# EAGLE design miwos (EAGLE 9.6.2)
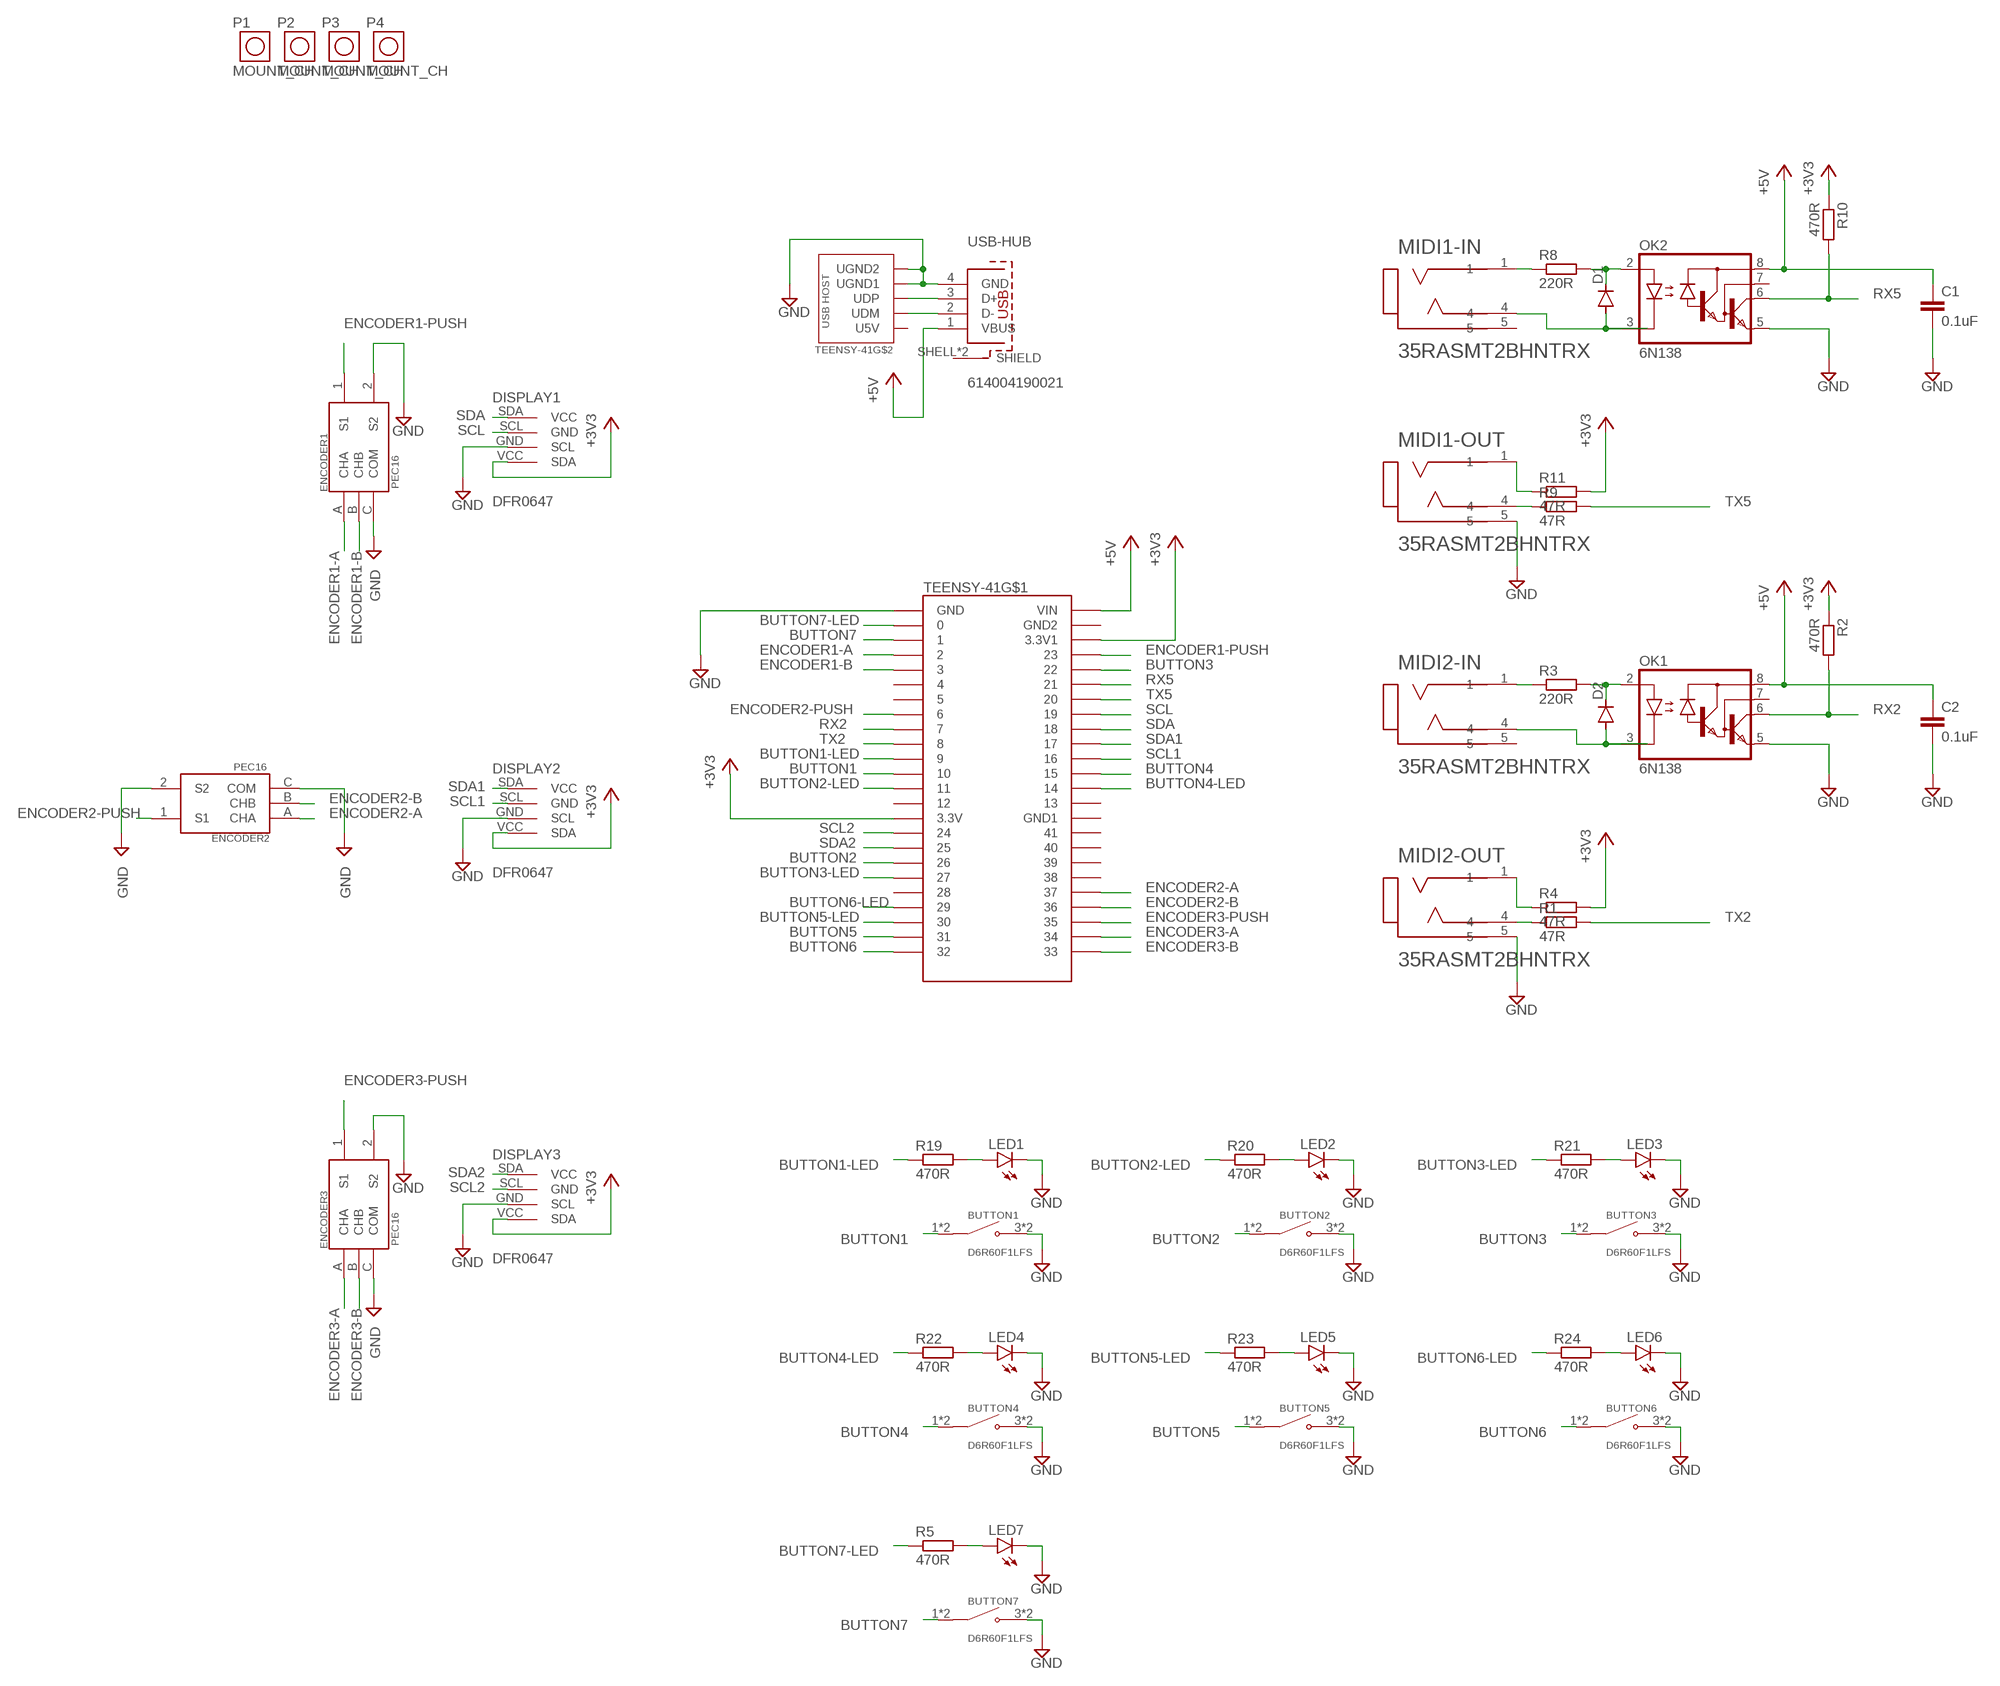
[diagram p0: schematic, sheet 1]

## Parts
BUTTON1  D6R60F1LFS  [D6R]
BUTTON2  D6R60F1LFS  [D6R]
BUTTON3  D6R60F1LFS  [D6R]
BUTTON4  D6R60F1LFS  [D6R]
BUTTON5  D6R60F1LFS  [D6R]
BUTTON6  D6R60F1LFS  [D6R]
BUTTON7  D6R60F1LFS  [D6R]
C1  0.1uF  C-EUC0603  [C0603]
C2  0.1uF  C-EUC0603  [C0603]
D1  DIODE-SOD123  [SOD123]
D2  DIODE-SOD123  [SOD123]
DISPLAY1  DFR0647  [DFR0647]
DISPLAY2  DFR0647  [DFR0647]
DISPLAY3  DFR0647  [DFR0647]
ENCODER1  PEC16  [PEC16]
ENCODER2  PEC16  [PEC16]
ENCODER3  PEC16  [PEC16]
LED1  LED3MM  [LED3MM]
LED2  LED3MM  [LED3MM]
LED3  LED3MM  [LED3MM]
LED4  LED3MM  [LED3MM]
LED5  LED3MM  [LED3MM]
LED6  LED3MM  [LED3MM]
LED7  LED3MM  [LED3MM]
MIDI1-IN  35RASMT2BHNTRX  [SWITCHCRAFT_35RASMT2BHNTRX]
MIDI1-OUT  35RASMT2BHNTRX  [SWITCHCRAFT_35RASMT2BHNTRX]
MIDI2-IN  35RASMT2BHNTRX  [SWITCHCRAFT_35RASMT2BHNTRX]
MIDI2-OUT  35RASMT2BHNTRX  [SWITCHCRAFT_35RASMT2BHNTRX]
OK1  6N138  [DIP08-SMD]
OK2  6N138  [DIP08-SMD]
P1  MOUNT_CH  [MOUNT_CH32]
P2  MOUNT_CH  [MOUNT_CH32]
P3  MOUNT_CH  [MOUNT_CH32]
P4  MOUNT_CH  [MOUNT_CH32]
R1  47R  R-EU_R0603  [R0603]
R2  470R  R-EU_R0603  [R0603]
R3  220R  R-EU_R0603  [R0603]
R4  47R  R-EU_R0603  [R0603]
R5  470R  R-EU_R0603  [R0603]
R8  220R  R-EU_R0603  [R0603]
R9  47R  R-EU_R0603  [R0603]
R10  470R  R-EU_R0603  [R0603]
R11  47R  R-EU_R0603  [R0603]
R19  470R  R-EU_R0603  [R0603]
R20  470R  R-EU_R0603  [R0603]
R21  470R  R-EU_R0603  [R0603]
R22  470R  R-EU_R0603  [R0603]
R23  470R  R-EU_R0603  [R0603]
R24  470R  R-EU_R0603  [R0603]
TEENSY-41  TEENSY4.1  [TEENSY4.1]
USB-HUB  614004190021  [614004190021]

## Nets
+3V3: DISPLAY1.VCC(SDA) DISPLAY2.VCC(SDA) DISPLAY3.VCC(SDA) R2.1 R4.2 R10.1 R11.2 TEENSY-41.3V3(3.3V) TEENSY-41.3V3_LO(3.3V1)
+5V: C1.1 C2.1 OK1.8(VCC) OK2.8(VCC) TEENSY-41.VIN USB-HUB.1(VBUS)
BUTTON1: BUTTON1.1(COM) BUTTON1.2(COM) TEENSY-41.10/CS
BUTTON1-LED: R19.1 TEENSY-41.9
BUTTON2: BUTTON2.1(COM) BUTTON2.2(COM) TEENSY-41.26
BUTTON2-LED: R20.1 TEENSY-41.11/MOSI
BUTTON3: BUTTON3.1(COM) BUTTON3.2(COM) TEENSY-41.22/A8
BUTTON3-LED: R21.1 TEENSY-41.27
BUTTON4: BUTTON4.1(COM) BUTTON4.2(COM) TEENSY-41.15/A1
BUTTON4-LED: R22.1 TEENSY-41.14/A0
BUTTON5: BUTTON5.1(COM) BUTTON5.2(COM) TEENSY-41.31/A12
BUTTON5-LED: R23.1 TEENSY-41.30
BUTTON6: BUTTON6.1(COM) BUTTON6.2(COM) TEENSY-41.32
BUTTON6-LED: R24.1 TEENSY-41.29
BUTTON7: BUTTON7.1(COM) BUTTON7.2(COM) TEENSY-41.1/TX
BUTTON7-LED: R5.1 TEENSY-41.0/RX
ENCODER1-A: ENCODER1.A(CHA) TEENSY-41.2
ENCODER1-B: ENCODER1.B(CHB) TEENSY-41.3
ENCODER1-PUSH: ENCODER1.1(S1) TEENSY-41.23/A9
ENCODER2-A: ENCODER2.A(CHA) TEENSY-41.37
ENCODER2-B: ENCODER2.B(CHB) TEENSY-41.36
ENCODER2-PUSH: ENCODER2.1(S1) TEENSY-41.6
ENCODER3-A: ENCODER3.A(CHA) TEENSY-41.34
ENCODER3-B: ENCODER3.B(CHB) TEENSY-41.33
ENCODER3-PUSH: ENCODER3.1(S1) TEENSY-41.35
GND: BUTTON1.3(NO) BUTTON1.4(NO) BUTTON2.3(NO) BUTTON2.4(NO) BUTTON3.3(NO) BUTTON3.4(NO) BUTTON4.3(NO) BUTTON4.4(NO) BUTTON5.3(NO) BUTTON5.4(NO) BUTTON6.3(NO) BUTTON6.4(NO) BUTTON7.3(NO) BUTTON7.4(NO) C1.2 C2.2 DISPLAY1.GND(SCL) DISPLAY2.GND(SCL) DISPLAY3.GND(SCL) ENCODER1.2(S2) ENCODER1.C(COM) ENCODER2.2(S2) ENCODER2.C(COM) ENCODER3.2(S2) ENCODER3.C(COM) LED1.K(C) LED2.K(C) LED3.K(C) LED4.K(C) LED5.K(C) LED6.K(C) LED7.K(C) MIDI1-OUT.5 MIDI2-OUT.5 OK1.5(GND) OK2.5(GND) TEENSY-41.GND TEENSY-41.GND-U1(UGND1) TEENSY-41.GND-U2(UGND2) USB-HUB.4(GND)
N$2: TEENSY-41.UD-(UDM) USB-HUB.2(D-)
N$3: TEENSY-41.UD+(UDP) USB-HUB.3(D+)
N$5: LED7.A R5.2
N$8: D1.C OK2.2(A) R8.2
N$9: D1.A MIDI1-IN.4 OK2.3(C)
N$10: MIDI1-IN.1 R8.1
N$11: MIDI1-OUT.4 R9.1
N$12: MIDI1-OUT.1 R11.1
N$16: D2.C OK1.2(A) R3.2
N$17: D2.A MIDI2-IN.4 OK1.3(C)
N$18: MIDI2-IN.1 R3.1
N$19: MIDI2-OUT.4 R1.1
N$21: MIDI2-OUT.1 R4.1
N$25: LED1.A R19.2
N$27: LED2.A R20.2
N$29: LED3.A R21.2
N$31: LED4.A R22.2
N$33: LED5.A R23.2
N$35: LED6.A R24.2
RX2: OK1.6(VO) R2.2 TEENSY-41.7
RX5: OK2.6(VO) R10.2 TEENSY-41.21/A7
SCL: DISPLAY1.SCL(GND) TEENSY-41.19/A5/SCL
SCL1: DISPLAY2.SCL(GND) TEENSY-41.16/A2
SCL2: DISPLAY3.SCL(GND) TEENSY-41.24
SDA: DISPLAY1.SDA(VCC) TEENSY-41.18/A4/SDA
SDA1: DISPLAY2.SDA(VCC) TEENSY-41.17/A3
SDA2: DISPLAY3.SDA(VCC) TEENSY-41.25
TX2: R1.2 TEENSY-41.8
TX5: R9.2 TEENSY-41.20/A6
Unconnected: MIDI1-IN.5 MIDI2-IN.5 OK1.7(VB) OK2.7(VB) P1.P$1 P2.P$1 P3.P$1 P4.P$1 TEENSY-41.4 TEENSY-41.5 TEENSY-41.12/MISO TEENSY-41.13/SCK TEENSY-41.28 TEENSY-41.38 TEENSY-41.39 TEENSY-41.40 TEENSY-41.41 TEENSY-41.AGND(GND2) TEENSY-41.GND1 TEENSY-41.UVHST(U5V) USB-HUB.SHELL1(SHIELD) USB-HUB.SHELL(SHIELD)

## Library data of the parts
BUTTON1-BUTTON7 = D6R:D6R60F1LFS: Pushbutton Switch SPST-NO Keyswitch Through Hole Check prices <https://pricing.snapeda.com/parts/D6R90%20F1%20LFS/C%26K/view-part?ref=eda>; AVAILABILITY: In Stock; DESCRIPTION: Pushbutton Switch SPST-NO Keyswitch Through Hole; MF: C&K; MP: D6R90 F1 LFS; PACKAGE: None; PRICE: None; PURCHASE-URL: https://pricing.snapeda.com/search/part/D6R90 F1 LFS/?ref=eda
C1 C2 = rcl:C-EU: CAPACITOR, European symbol; SPICEPREFIX: C
D1 D2 = diode:DIODE-: DIODE
DISPLAY1-DISPLAY3 = DFR0647:DFR0647
ENCODER1-ENCODER3 = PEC16:PEC16: Encoder 12mm 0detents 20mm Shft Push Momentry Sw 24 Pulse Check prices <https://pricing.snapeda.com/parts/PEC12R-4025F-S0024/Bourns/view-part?ref=eda>; AVAILABILITY: In Stock; DESCRIPTION: Rotary Encoder Mechanical 24 Quadrature (Incremental) Vertical; MF: Bourns; MP: PEC12R-4025F-S0024; PACKAGE: None; PRICE: None; PURCHASE-URL: https://pricing.snapeda.com/search/part/PEC12R-4025F-S0024/?ref=eda
LED1-LED7 = led:LED: LED OSRAM: - CHIPLED LG R971, LG N971, LY N971, LG Q971, LY Q971, LO R971, LY R971 LH N974, LH R974 LS Q976, LO Q976, LY Q976 LO Q996 - Hyper CHIPLED LW Q18S LB Q993, LB Q99A, LB R99A - SideLED LS A670, LO A670, LY A670, LG A670, LP A670 LB A673, LV A673, LT A673, LW A673 LH A674 LY A675 LS A676, LA A676, LO A676, LY A676, LW A676 LS A679, LY A679, LG A679 - Hyper Micro SIDELED® LS Y876, LA Y876, LO Y876, LY Y876 LT Y87S - SmartLED LW L88C, LW L88S LB L89C, LB L89S, LG L890 LS L89K, LO L89K, LY L89K LS L896, LA L896, LO L896, LY L896 - TOPLED LS T670, LO T670, LY T670, LG T670, LP T670 LSG T670, LSP T670, LSY T670, LOP T670, LYG T670 LG T671, LOG T671, LSG T671 LB T673, LV T673, LT T673, LW T673 LH T674 LS T676, LA T676, LO T676, LY T676, LB T676, LH T676, LSB T676, LW T676 LB T67C, LV T67C, LT T67C, LS T67K, LO T67K, LY T67K, LW E67C LS E67B, LA E67B, LO E67B, LY E67B, LB E67C, LV E67C, LT E67C LW T67C LS T679, LY T679, LG T679 LS T770, LO T770, LY T770, LG T770, LP T770 LB T773, LV T773, LT T773, LW T773 LH T774 LS E675, LA E675, LY E675, LS T675 LS T776, LA T776, LO T776, LY T776, LB T776 LHGB T686 LT T68C, LB T68C - Hyper Mini TOPLED® LB M676 - Mini TOPLED Santana® LG M470 LS M47K, LO M47K, LY M47K Source: http://www.osram.convergy.de LUXEON: - LUMILED® LXK2-PW12-R00, LXK2-PW12-S00, LXK2-PW14-U00, LXK2-PW14-V00 LXK2-PM12-R00, LXK2-PM12-S00, LXK2-PM14-U00 LXK2-PE12-Q00, LXK2-PE12-R00, LXK2-PE12-S00, LXK2-PE14-T00, LXK2-PE14-U00 LXK2-PB12-K00, LXK2-PB12-L00, LXK2-PB12-M00, LXK2-PB14-N00, LXK2-PB14-P00, LXK2-PB14-Q00 LXK2-PR12-L00, LXK2-PR12-M00, LXK2-PR14-Q00, LXK2-PR14-R00 LXK2-PD12-Q00, LXK2-PD12-R00, LXK2-PD12-S00 LXK2-PH12-R00, LXK2-PH12-S00 LXK2-PL12-P00, LXK2-PL12-Q00, LXK2-PL12-R00 Source: www.luxeon.com KINGBRIGHT: KA-3528ASYC Source: www.kingbright.com
MIDI1-IN MIDI1-OUT MIDI2-IN MIDI2-OUT = 35RASMT2BHNTRX:35RASMT2BHNTRX: Conn 3.5MM Stereo Jack F 3 POS Solder RA SMD 3 Terminal 1 Port T/R Check availability <https://pricing.snapeda.com/parts/35RASMT2BHNTRX/Switchcraft%20Inc./view-part?ref=eda>; AVAILABILITY: In Stock; DESCRIPTION: 3.50mm (0.141, 1/8, Mini Plug) - Headphone Phone Jack Stereo (3 Conductor, TRS) Connector Solder; MF: Switchcraft Inc.; MP: 35RASMT2BHNTRX; PACKAGE: None; PRICE: None; PURCHASE-URL: https://pricing.snapeda.com/search/part/35RASMT2BHNTRX/?ref=eda
OK1 OK2 = 6N138:6N138; MF: VISHAY/TELEFUNKEN; MPN: 6N138; OC_FARNELL: 9860150; OC_NEWARK: 35K5294
P1-P4 = sol_pin:MOUNT_CH: mounting hole 3,2 mm M3
R1-R5 R8-R11 R19-R24 = rcl:R-EU_: RESISTOR, European symbol; SPICEPREFIX: R
TEENSY-41 = teensy4.1.dist:TEENSY4.1
USB-HUB = 614004190021:614004190021: USB TYPE A UP RIGHT THT - SHORT TYPE =>ConUSB2 614004190021 Characteristics INSULATOR:PBT FLAMMABILITY RATING: UL94-V0 COLOR: WHITE CONTACT PLATING: GOLD OVER Ni COVER MATERIAL: BRASS COVER PLATING: Ni QUALITY CLASS: 15000 MATING CYCLES OPERATING TEMPERATURE:-40°C UP TO +85°C COMPLIANCE: LEAD FREE AND ROHS ELECTRICAL CURRENT RATING: - PIN 1 & PIN 4: 3A - OTHER PINS: 0,5A WORKING VOLTAGE: 30 VAC MAX WITHSTANDING VOLTAGE: 500 VAC/MIN INSULATION RESISTANCE: > 1000 MΩ CONTACT RESISTANCE: 30 mΩ MAX <http://katalog.we-online.de/media/images/v2/Family_WR-COM_614004190021_4C.jpg> Details see: http://katalog.we-online.de/en/em/COM_2_0_THT_TYPE_A_HORIZONTAL/614004190021? 2015 (C) Wurth Elektronik Check prices <https://pricing.snapeda.com/parts/614004190021/W%C3%BCrth%20Elektronik/view-part?ref=eda>; AVAILABILITY: In Stock; DESCRIPTION: USB-A (USB TYPE-A) USB 2.0 Receptacle Connector 4 Position Through Hole, Right Angle; MF: Würth Elektronik; MP: 614004190021; PACKAGE: None; PRICE: None; PURCHASE-URL: https://pricing.snapeda.com/search/part/614004190021/?ref=eda

## Board
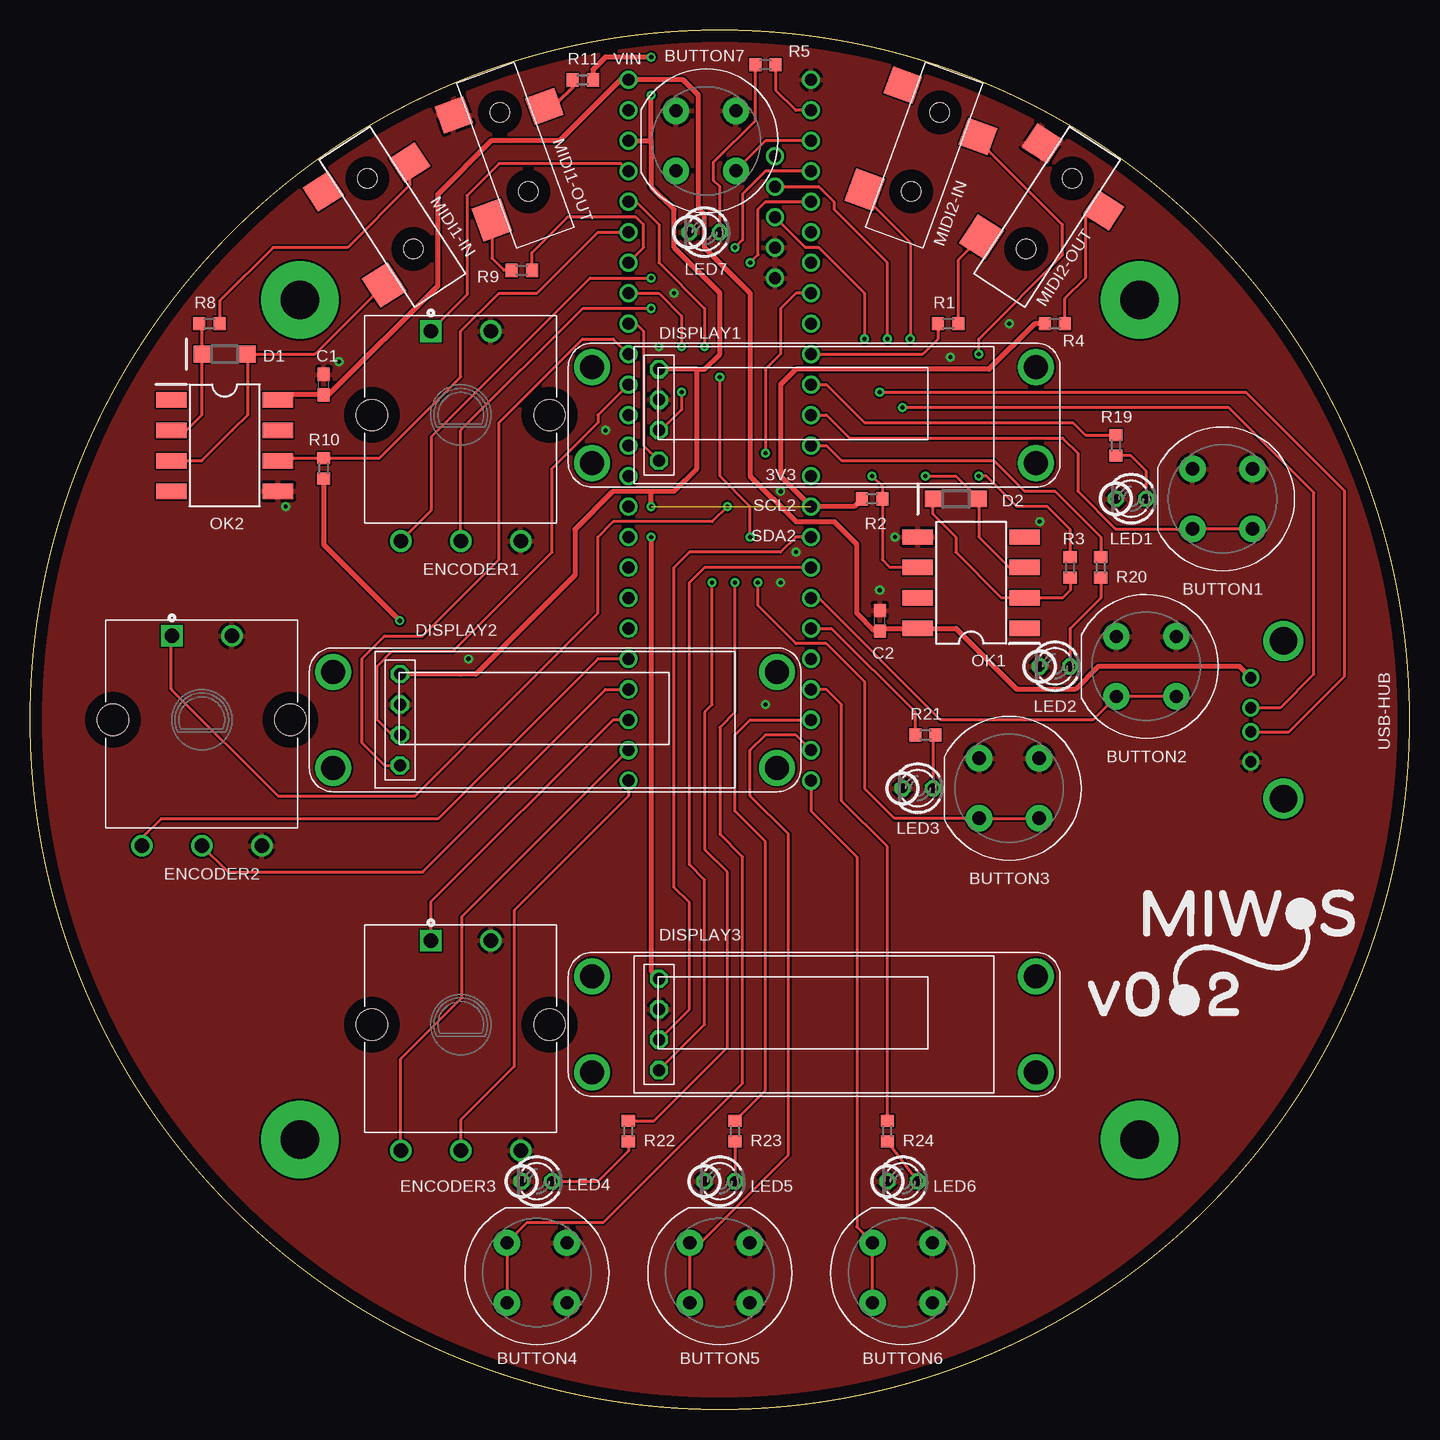
[diagram p1: board, top side]
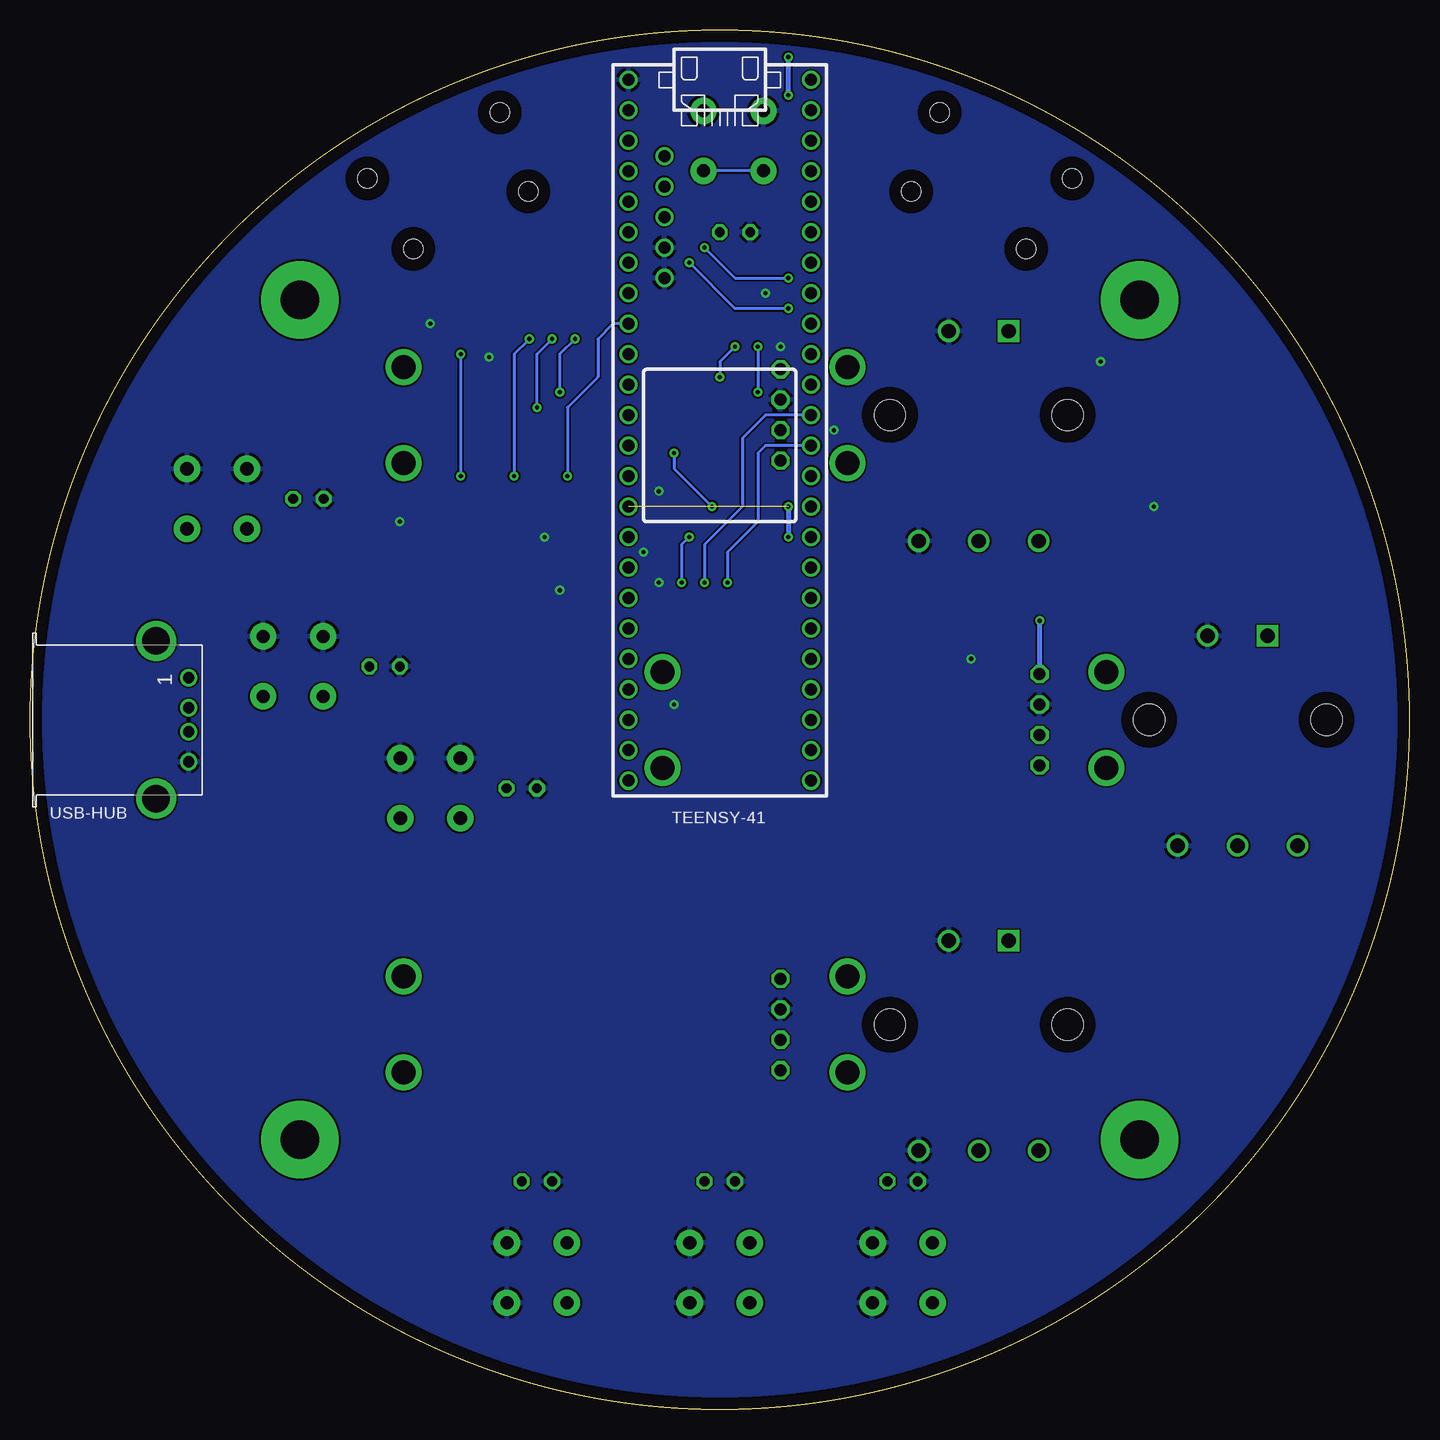
[diagram p2: board, bottom side, seen from below]

Size 115 x 115 mm. Coordinates in mm from the lower left corner, seen from the top.
Outline: circle at 57.5,57.5 radius 57.5
Copper layers (1*16): Top 0.035mm / dielectric 1.5mm / Bottom 0.035mm
Design rules "default": minimum track width 6mil, minimum drill 0.35mm, track to track 6mil, track to pad 6mil, pad to pad 6mil, via to via 6mil, smd to smd 6mil, copper to edge 40mil, drill to drill 6mil, minimum pad ring 10mil, minimum via ring 8mil, stop-mask expansion 4mil, vias tented up to drill 0mil, thermal gap 10mil

### Footprints (pad centres in the part's own frame; a part is rotated, then mirrored left to right if it is on the bottom)
D6R = drill 1.1 pad 2.2: 1 -2.5,2.5; 2 -2.5,-2.5; 3 2.5,-2.5; 4 2.5,2.5
C0603 = smd 1.1 x 1: 1 -0.85,0; 2 0.85,0
SOD123 = smd 1.4 x 1.4: A 1.9,0; C -1.9,0
DFR0647 = drill 1 pad 1.5 octagon: GND -12.95,1.27; SCL -12.95,-1.27; SDA -12.95,-3.81; VCC -12.95,3.81 | drill 2: P$1 18.5,-4; P$2 -18.5,-4; P$3 18.5,4; P$4 -18.5,4
PEC16 = drill 1.2 pad 1.8 square: 1 7,2.5 | drill 1.2 pad 1.8: 2 7,-2.5; A -10.5,5; B -10.5,0; C -10.5,-5 | hole 2.6: 0,7.4; 0,-7.4
LED3MM = drill 0.813 octagon: A -1.27,0; K 1.27,0
SWITCHCRAFT_35RASMT2BHNTRX = smd 2.4 x 2.55: 1 -2.7,3.675; 5 -4.6,-3.675 | smd 2.9 x 2.55: 4 4.7,-3.675 | hole 1.6: -3.5,0; 3.5,0
DIP08-SMD = smd 1.27 x 2.54: 1 -3.81,-4.445; 2 -1.27,-4.445; 3 1.27,-4.445; 4 3.81,-4.445; 5 3.81,4.445; 6 1.27,4.445; 7 -1.27,4.445; 8 -3.81,4.445
MOUNT_CH32 = drill 3.175 pad 6.452: P$1 0,0
R0603 = smd 1 x 1.1: 1 -0.85,0; 2 0.85,0
TEENSY4.1 = drill 1: 0/RX -26.67,-7.62; 1/TX -24.13,-7.62; 2 -21.59,-7.62; 3 -19.05,-7.62; 3V3 6.35,-7.62; 3V3_LO -24.13,7.62; 4 -16.51,-7.62; 5 -13.97,-7.62; 6 -11.43,-7.62; 7 -8.89,-7.62; 8 -6.35,-7.62; 9 -3.81,-7.62; 10/CS -1.27,-7.62; 11/MOSI 1.27,-7.62; 12/MISO 3.81,-7.62; 13/SCK 3.81,7.62; 14/A0 1.27,7.62; 15/A1 -1.27,7.62; 16/A2 -3.81,7.62; 17/A3 -6.35,7.62; 18/A4/SDA -8.89,7.62; 19/A5/SCL -11.43,7.62; 20/A6 -13.97,7.62; 21/A7 -16.51,7.62; 22/A8 -19.05,7.62; 23/A9 -21.59,7.62; 24 8.89,-7.62; 25 11.43,-7.62; 26 13.97,-7.62; 27 16.51,-7.62; 28 19.05,-7.62; 29 21.59,-7.62; 30 24.13,-7.62; 31/A12 26.67,-7.62; 32 29.21,-7.62; 33 29.21,7.62; 34 26.67,7.62; 35 24.13,7.62; 36 21.59,7.62; 37 19.05,7.62; 38 16.51,7.62; 39 13.97,7.62; 40 11.43,7.62; 41 8.89,7.62; AGND -26.67,7.62; GND -29.21,-7.62; GND1 6.35,7.62; GND-U1 -15.24,-4.62; GND-U2 -12.7,-4.62; UD+ -17.78,-4.62; UD- -20.32,-4.62; UVHST -22.86,-4.62; VIN -29.21,7.62
614004190021 = drill 0.92: 1 -3.5,2.71; 2 -1,2.71; 3 1,2.71; 4 3.5,2.71 | drill 2.3: SHELL -6.57,0; SHELL1 6.57,0

### Placement (x,y rotation side)
BUTTON1  99.41,75.91 90 top
BUTTON2  93.06,61.95 90 top
BUTTON3  81.63,51.78 90 top
BUTTON4  42.26,11.4 0 top
BUTTON5  57.5,11.4 0 top
BUTTON6  72.74,11.4 0 top
BUTTON7  56.36,105.76 90 top
C1  24.48,85.44 90 top
C2  70.84,65.75 90 top
D1  16.23,87.98 0 top
D2  77.19,75.91 0 top
DISPLAY1  65.37,82.9 0 top
DISPLAY2  43.78,57.5 0 top
DISPLAY3  65.37,32.1 0 top
ENCODER1  35.91,82.9 90 top
ENCODER2  14.32,57.5 90 top
ENCODER3  35.91,32.1 90 top
LED1  91.79,75.91 180 top
LED2  85.44,61.95 180 top
LED3  74.01,51.78 180 top
LED4  42.26,19.02 180 top
LED5  57.5,19.02 180 top
LED6  72.74,19.02 180 top
LED7  56.23,98.14 180 top
MIDI1-IN  30.04,99.69 303 top
MIDI1-OUT  40.36,104.85 290 top
MIDI2-IN  74.64,104.85 250 top
MIDI2-OUT  84.96,99.69 237 top
OK1  78.45,68.93 90 top
OK2  16.23,80.36 270 top
P1  22.5,92.5 0 top
P2  22.5,22.5 0 top
P3  92.5,92.5 0 top
P4  92.5,22.5 0 top
R1  76.55,90.52 180 top
R2  70.2,75.91 0 top
R3  86.71,70.2 270 top
R4  85.44,90.52 180 top
R5  61.31,112.11 180 top
R8  14.95,90.52 180 top
R9  40.99,94.97 0 top
R10  24.48,78.45 90 top
R11  46.07,110.84 0 top
R19  90.52,80.36 270 top
R20  89.25,70.2 270 top
R21  74.64,56.23 0 top
R22  49.88,23.21 270 top
R23  58.77,23.21 270 top
R24  71.47,23.21 270 top
TEENSY-41  57.5,81.63 270 bottom
USB-HUB  104.49,57.5 270 bottom

### Tracks (layer width: path | path; a pad name or v marks a point on that pad's centre or on a via)
+3V3  (via drill 0.35)  (1 unrouted)
  Top 0.406: 46.83,110.84 R11.2 46.92,111.69 47.98,112.75 v51.78,112.75 | R4.2 83.75,90.52 79.94,86.71 63.85,86.71 62.58,85.44 62.58,77.82 TEENSY-41.3V3 68.72,75.28 R2.1 | v30.83,65.75 24.48,72.11 R10.1 | 51.78,76.55 48.61,76.55 45.44,73.38 45.44,69.56 37.18,61.31 35.91,61.31 | 55.59,86.71 DISPLAY1.VCC | TEENSY-41.3V3_LO 51.78,105.76 | 51.78,105.76 51.78,101.95 53.69,100.05 53.69,96.87 57.5,93.06 57.5,87.98 56.23,86.71 55.59,86.71 | 51.78,105.76 v51.78,109.57 | 35.91,61.31 DISPLAY2.VCC | 35.91,61.31 | v51.78,75.28 51.78,76.55 | DISPLAY3.VCC 51.78,36.55 v51.78,72.74 | 51.78,76.55 53.69,76.55 55.59,78.45 55.59,86.71
  Bottom 0.406: DISPLAY2.VCC v30.83,65.75 | v51.78,109.57 v51.78,112.75 | v51.78,75.28 v51.78,72.74
+5V
  Top 0.406: OK2.8 20.25,84.17 20.67,84.59 C1.1 24.9,84.59 34,93.69 34,101.31 38.45,105.76 44.16,105.76 49.24,110.84 TEENSY-41.VIN 54.45,110.84 55.72,109.57 55.72,100.17 56.23,99.66 56.23,96.87 60.04,93.06 60.04,77.82 63.85,74.01 67.03,74.01 68.93,72.11 68.93,66.39 70.41,64.91 C2.1 71.05,65.12 OK1.8 77.19,65.12 82.27,60.04 87.13,60.04 89.03,61.95 100.84,61.95 USB-HUB.1
BUTTON1
  Top 0.254: BUTTON1.2 BUTTON1.1 90.48,73.41 87.34,76.55 87.34,79.72 86.08,81 68.3,81 66.39,82.9 TEENSY-41.10/CS
BUTTON1-LED
  Top 0.254: TEENSY-41.9 66.39,85.44 69.56,82.27 86.92,82.27 87.98,81.21 R19.1
BUTTON2
  Top 0.254: BUTTON2.2 BUTTON2.1 88.61,57.5 75.91,57.5 65.75,67.66 TEENSY-41.26
BUTTON2-LED
  Top 0.254: TEENSY-41.11/MOSI 66.39,80.36 67.66,79.09 80.36,79.09 82.9,76.55 85.44,76.55 89.25,72.74 R20.1
BUTTON3  (via drill 0.35)
  Top 0.254: BUTTON3.2 BUTTON3.1 72.06,49.28 69.56,51.78 69.56,60.67 66.39,63.85 63.85,63.85 60.67,67.03 v60.67,68.93 | v56.23,88.61 56.23,91.79 52.42,95.6 52.42,98.78 50.52,100.68 TEENSY-41.22/A8 | v60.04,72.74 60.04,75.28 57.5,77.82 v57.5,86.08
  Bottom 0.254: v57.5,86.08 57.5,87.34 v56.23,88.61 | v60.67,68.93 60.67,72.11 v60.04,72.74
BUTTON3-LED
  Top 0.254: R21.1 73.8,58.13 66.81,65.12 TEENSY-41.27
BUTTON4  (via drill 0.35)
  Top 0.254: BUTTON4.2 BUTTON4.1 41.45,15.59 47.8,15.59 59.41,27.19 59.41,46.07 57.5,47.98 57.5,56.87 58.77,58.13 v58.77,68.93
  Bottom 0.254: TEENSY-41.15/A1 53.69,82.9 55.59,81 55.59,75.28 58.77,72.11 v58.77,68.93
BUTTON4-LED  (via drill 0.35)
  Top 0.254: R22.1 52,24.06 58.13,30.2 58.13,44.8 56.23,46.7 56.23,58.13 56.87,58.77 v56.87,68.93
  Bottom 0.254: v56.87,68.93 56.87,71.47 54.33,74.01 54.33,79.72 53.69,80.36 TEENSY-41.14/A0
BUTTON5
  Top 0.254: TEENSY-41.31/A12 63.85,56.23 61.31,56.23 60.04,54.96 60.04,51.15 63.22,47.98 63.22,21.23 55.89,13.9 BUTTON5.1 BUTTON5.2
BUTTON5-LED
  Top 0.254: TEENSY-41.30 60.04,57.5 58.77,56.23 58.77,49.88 61.31,47.34 61.31,26.6 R23.1
BUTTON6
  Top 0.254: TEENSY-41.32 65.12,49.88 68.93,46.07 68.93,15.21 BUTTON6.1 BUTTON6.2
BUTTON6-LED
  Top 0.254: R24.1 71.47,46.92 67.66,50.73 67.66,58.77 66.39,60.04 TEENSY-41.29
BUTTON7
  Top 0.254: TEENSY-41.1/TX 61.31,105.76 58.86,103.31 BUTTON7.2
  Bottom 0.254: BUTTON7.1 BUTTON7.2
BUTTON7-LED
  Top 0.254: TEENSY-41.0/RX 63.85,108.3 62.16,109.99 R5.1
ENCODER1-A  (via drill 0.35)
  Top 0.254: ENCODER1.A 33.45,74.94 33.45,81.08 46.7,94.33 v51.78,94.33 | TEENSY-41.2 61.31,103.22 59.41,101.31 59.41,97.5 v58.77,96.87
  Bottom 0.254: v51.78,94.33 56.23,94.33 v58.77,96.87
ENCODER1-B  (via drill 0.35)
  Top 0.254: ENCODER1.B 35.91,81.63 46.07,91.79 v51.78,91.79 | v60.04,95.6 60.7,96.26 60.7,100.07 61.31,100.68 TEENSY-41.3
  Bottom 0.254: v51.78,91.79 56.23,91.79 v60.04,95.6
ENCODER1-PUSH
  Top 0.254: TEENSY-41.23/A9 49.24,103.85 39.09,103.85 36.43,101.2 36.43,92.92 ENCODER1.1
ENCODER2-A
  Top 0.254: TEENSY-41.37 47.34,62.58 34,49.24 10.93,49.24 9.32,47.63 ENCODER2.A
ENCODER2-B
  Top 0.254: TEENSY-41.36 47.98,60.04 32.73,44.8 16.52,44.8 ENCODER2.B
ENCODER2-PUSH  (via drill 0.35)
  Top 0.254: TEENSY-41.6 63.85,93.06 62.58,91.79 62.58,87.98 61.31,86.71 v61.31,79.72 | ENCODER2.1 11.78,64.46 11.78,60.04 20.67,51.15 32.1,51.15 47.34,66.39 47.34,72.74 48.61,74.01 56.87,74.01 v58.13,75.28
  Bottom 0.254: v61.31,79.72 61.31,78.45 v58.13,75.28
ENCODER3-A
  Top 0.254: ENCODER3.A 30.91,29.22 35.99,34.3 35.99,41.07 TEENSY-41.34
ENCODER3-B
  Top 0.254: ENCODER3.B 35.91,24.14 40.36,28.59 40.36,41.62 49.88,51.15 TEENSY-41.33
ENCODER3-PUSH
  Top 0.254: ENCODER3.1 33.41,42.3 48.61,57.5 TEENSY-41.35
GND  (via drill 0.35)
  other vias: 61.31,58.77 63.85,71.47 25.75,87.34 21.3,75.28 70.84,68.3 72.11,72.74 84.17,74.01 62.58,76.55 76.74,87.74 81.63,90.52 36.55,62.58 53.69,93.06 52.42,88.61 47.98,81.63 62.58,68.93
  pour Top: -3.46,-3.46 118.46,-3.46 118.46,118.46 -3.46,118.46
  pour Bottom: -3.46,-3.46 118.46,-3.46 118.46,118.46 -3.46,118.46
N$2  (via drill 0.35)
  Top 0.254: USB-HUB.2 104.22,58.5 107.03,61.31 107.03,76.42 99.92,83.53 v72.74,83.53 | TEENSY-41.UD- 65.75,101.95 67.03,100.68 67.03,100.05 71.47,95.6 v71.47,89.25
  Bottom 0.254: v72.74,83.53 72.74,87.98 v71.47,89.25
N$3  (via drill 0.35)
  Top 0.254: USB-HUB.3 104.95,56.5 109.57,61.12 109.57,76.6 101.36,84.81 v70.84,84.81 | TEENSY-41.UD+ 64.66,96.87 65.75,96.87 69.56,93.06 v69.56,89.25
  Bottom 0.254: v69.56,89.25 70.84,87.98 v70.84,84.81
N$5
  Top 0.254: R5.2 60.46,107.45 56.99,103.98 56.99,102.46 57.5,101.95 LED7.A
N$8
  Top 0.254: R8.2 14.33,90.3 D1.C 14.32,82.9 13.05,81.63 OK2.2
N$9
  Top 0.254: OK2.3 14.32,79.09 16.86,81.63 16.86,81.64 18.12,82.9 D1.A 23.75,87.98 MIDI1-IN.4
N$10
  Top 0.254: MIDI1-IN.1 31.65,102.05 26.47,96.87 20.25,96.87 15.8,92.42 R8.1
N$11
  Top 0.254: R9.1 39.5,94.97 38.51,95.96 MIDI1-OUT.4
N$12
  Top 0.305: MIDI1-OUT.1 43.95,108.64 43.95,108.94 45.22,110.2 R11.1
N$16
  Top 0.254: D2.C 75.28,74.64 77.19,72.75 77.19,71.47 81,67.66 OK1.2 86.08,67.66 86.71,68.3 R3.2
N$17  (via drill 0.35)
  Top 0.254: OK1.3 81.63,70.2 79.09,72.75 D2.A 77.18,77.82 v74.64,77.82 | MIDI2-IN.4 69.58,101.05 73.38,97.26 v73.38,89.25
  Bottom 0.254: v74.64,77.82 74.64,87.98 v73.38,89.25
N$18  (via drill 0.35)
  Top 0.254: v79.09,77.82 79.72,77.82 82.27,75.28 84.81,75.28 86.71,73.38 R3.1 | MIDI2-IN.1 79.02,105.83 86.08,98.78 86.08,96.23 79.09,89.25 v79.09,87.98
  Bottom 0.254: v79.09,87.98 v79.09,77.82
N$19
  Top 0.254: R1.1 77.4,95.83 MIDI2-OUT.4
N$21
  Top 0.254: R4.1 86.29,92.64 87.98,94.33 87.98,99.62 88.31,99.95 MIDI2-OUT.1
N$25
  Top 0.254: LED1.A 93.06,78.24 91.79,79.51 R19.2
N$27
  Top 0.254: LED2.A 86.71,65.12 89.25,67.66 R20.2
N$29
  Top 0.254: R21.2 75.28,56.02 LED3.A
N$31
  Top 0.254: R22.2 49.88,21.56 47.34,19.02 LED4.A
N$33
  Top 0.254: R23.2 LED5.A
N$35
  Top 0.254: R24.2 LED6.A
RX2  (via drill 0.35)
  Top 0.254: OK1.6 71.69,70.2 71.05,70.84 R2.2 71.05,76.97 v70.2,77.82
  Bottom 0.254: v70.2,77.82 70.2,83.53 67.66,86.08 67.66,89.25 66.39,90.52 TEENSY-41.7
RX5
  Top 0.254: OK2.6 20.88,79.31 R10.2 29.14,79.31 35.91,86.08 35.91,89.88 39.09,93.06 42.26,93.06 47.34,98.14 TEENSY-41.21/A7
SCL  (via drill 0.35)
  Top 0.254: TEENSY-41.19/A5/SCL 52.42,93.06 54.33,91.16 v54.33,88.61 | DISPLAY1.SCL 52.62,81.63 54.33,83.34 v54.33,84.81
  Bottom 0.254: v54.33,88.61 v54.33,84.81
SCL1
  Top 0.254: TEENSY-41.16/A2 47.34,82.9 47.34,82.27 43.53,78.45 43.53,71.47 35.27,63.22 30.2,63.22 28.93,61.95 28.93,57.5 30.2,56.23 DISPLAY2.SCL
SCL2
  Top 0.254: TEENSY-41.24 63.85,72.74 62.58,71.47 54.96,71.47 53.69,70.2 53.69,43.53 54.96,42.26 54.96,33.37 DISPLAY3.SCL
SDA
  Top 0.254: DISPLAY1.SDA 51.15,80.36 51.15,89.88 50.52,90.52 TEENSY-41.18/A4/SDA
SDA1
  Top 0.254: TEENSY-41.17/A3 48.61,89.25 46.07,89.25 39.09,82.27 39.09,70.84 32.73,64.48 29.56,64.48 27.66,62.58 27.66,55.59 29.56,53.69 DISPLAY2.SDA
SDA2
  Top 0.254: TEENSY-41.25 56.23,70.2 54.96,68.93 54.96,45.44 56.23,44.16 56.23,32.1 DISPLAY3.SDA
TX2
  Top 0.254: TEENSY-41.8 74.43,87.98 75.7,89.25 R1.2
TX5
  Top 0.254: TEENSY-41.20/A6 51.15,96.87 51.15,98.78 50.52,99.41 44.8,99.41 41.84,96.45 R9.2

### Text on the board
tNames: VIN | 3V3 | SCL2 | SDA2 | USB-HUB